# EAGLE schematic mainBoard_GTernal_1-1 v27 (EAGLE 9.7.0)

## Sheet 1 of 5
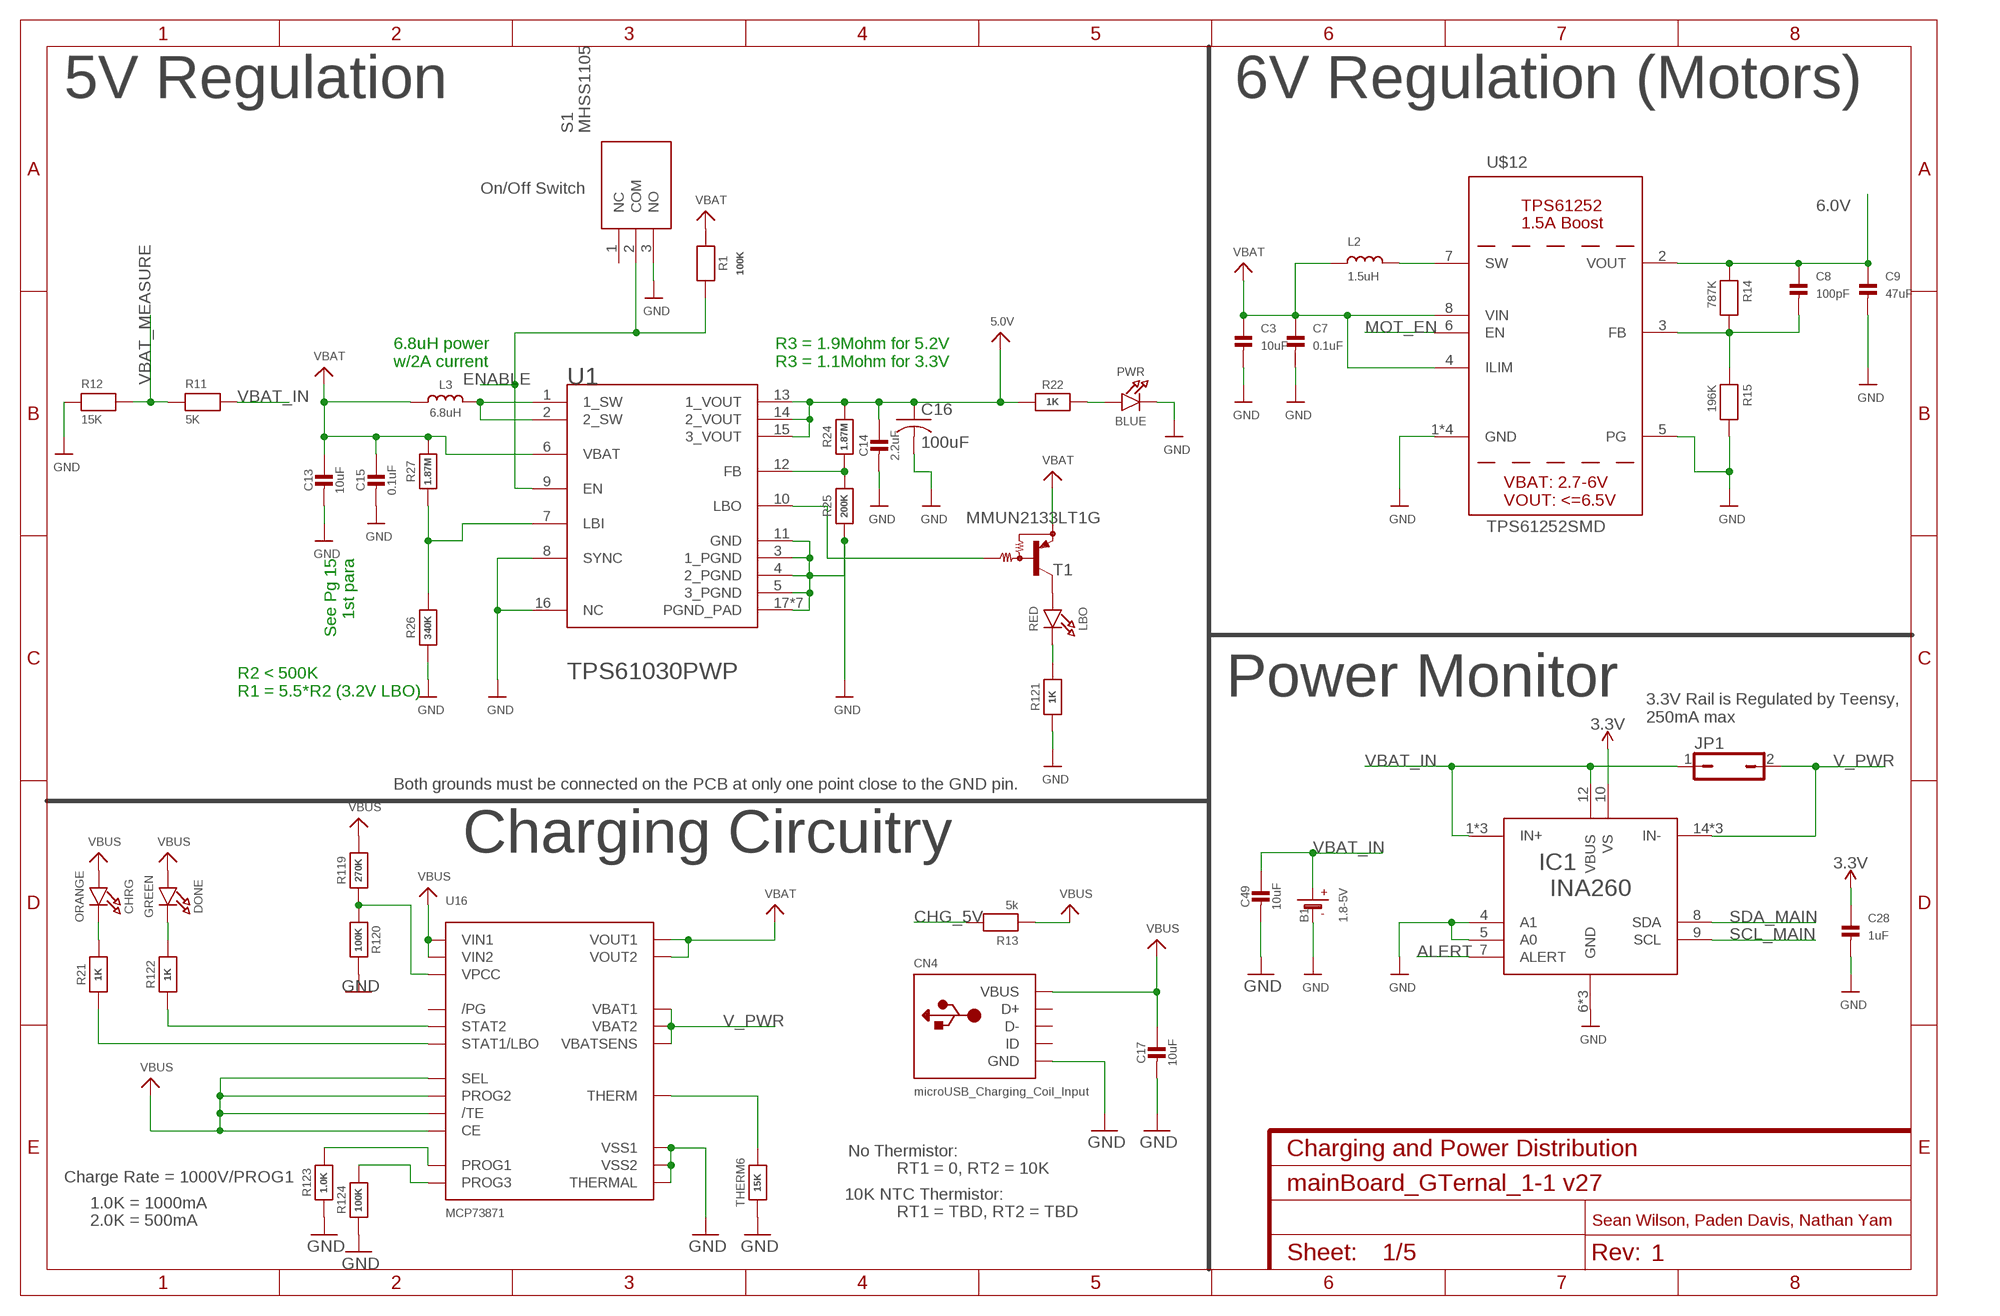
[diagram p0: schematic, sheet 1]
FRAME1 (FRAME-A4L): CNAME: Charging and Power Distribution; CREVISION: 1; DESIGNER: Sean Wilson, Paden Davis, Nathan Yam

### Parts
B1  1.8-5V  BATTERY  [JSTPH2]
C3  10uF  CAP_CERAMIC0603  [0603]
C7  0.1uF  CAP_CERAMIC0805  [0805]
C8  100pF  CAP_CERAMIC0603  [0603]
C9  47uF  CAP_CERAMIC1206  [1206]
C13  10uF  CAP_CERAMIC0805-NOOUTLINE  [0805-NO]
C14  2.2uF  CAP_CERAMIC0805-NOOUTLINE  [0805-NO]
C15  0.1uF  CAP_CERAMIC0805_10MGAP  [0805_10MGAP]
C16  100uF  C-USC1210  [C1210]
C17  10uF  CAP_CERAMIC0805-NOOUTLINE  [0805-NO]
C28  1uF  CAP_CERAMIC0603_NO  [0603-NO]
C49  10uF  CAP_CERAMIC0805-NOOUTLINE  [0805-NO]
CHRG  ORANGE  LED0805_NOOUTLINE  [CHIPLED_0805_NOOUTLINE]
CN4  microUSB_Charging_Coil_Input  USBMICRO_20329  [4UCONN_20329]
DONE  GREEN  LED0805_NOOUTLINE  [CHIPLED_0805_NOOUTLINE]
IC1  INA260  [TSSOP16]
JP1  JP1Q  [JP1]
L2  1.5uH  MURATA_DFE252012P-1R5M=P2  [MURATA_DFE252012P-1R5M=P2]
L3  6.8uH  INDUCTORTDK_VLC5045  [INDUCTOR_5X5MM_TDK_VLC5045]
LBO  RED  LED0805_NOOUTLINE  [CHIPLED_0805_NOOUTLINE]
PWR  BLUE  LED0805_NOOUTLINE  [CHIPLED_0805_NOOUTLINE]
R1  100K  RESISTOR0805_NOOUTLINE  [0805-NO]
R11  5K  RESISTOR0805  [0805]
R12  15K  RESISTOR0805  [0805]
R13  5k  RESISTOR0805  [0805]
R14  787K  RESISTOR0805  [0805]
R15  196K  RESISTOR0805  [0805]
R21  1K  RESISTOR0805_NOOUTLINE  [0805-NO]
R22  1K  RESISTOR0805_NOOUTLINE  [0805-NO]
R24  1.87M  RESISTOR0805_NOOUTLINE  [0805-NO]
R25  200K  RESISTOR0805_NOOUTLINE  [0805-NO]
R26  340K  RESISTOR_0805MP  [_0805MP]
R27  1.87M  RESISTOR_0805MP  [_0805MP]
R119  270K  RESISTOR0805_NOOUTLINE  [0805-NO]
R120  100K  RESISTOR0805_NOOUTLINE  [0805-NO]
R121  1K  RESISTOR0805_NOOUTLINE  [0805-NO]
R122  1K  RESISTOR0805_NOOUTLINE  [0805-NO]
R123  1.0K  RESISTOR0805_NOOUTLINE  [0805-NO]
R124  100K  RESISTOR0805_NOOUTLINE  [0805-NO]
S1  MHSS1105  [MHSS1105]
T1  MMUN2133LT1G  MUN2114T1-PNP_DRIVER-SC59-BEC  [SC59-BEC]
THERM6  15K  RESISTOR0805_NOOUTLINE  [0805-NO]
U1  TEXAS_INSTRUMENTS_TPS61030PWPTEXAS_INSTRUMENTS_TPS61030PWP_0_0  [TEXAS_INSTRUMENTS_TPS61030PWP_0]
U16  MCP73871  [QFN20_4MM]
U$12  TPS61252SMD  [TPS61252]

### Nets
3.3V: C28.1 IC1.10(VS) ; also sheet 2,4,5
5.0V: C14.1 C16.1 R22.1 R24.2 U1.13(1_VOUT) U1.14(2_VOUT) U1.15(3_VOUT) ; also sheet 2,3,5
6.0V: C8.1 C9.1 R14.1 U$12.2(VOUT) ; also sheet 3
ALERT: IC1.7(ALERT)
CHG_5V: R13.2 ; also sheet 2
ENABLE: R1.2 S1.2(COM) U1.9(EN)
GND: B1.1(-) C3.2 C7.2 C9.2 C13.2 C14.2 C15.2 C16.2 C17.2 C28.2 C49.2 CN4.BASE@1(GND) CN4.BASE@2(GND) CN4.GND CN4.SPRT@1(GND) CN4.SPRT@2(GND) CN4.SPRT@3(GND) CN4.SPRT@4(GND) IC1.4(A1) IC1.5(A0) IC1.6(GND) IC1.11(GND) IC1.13(GND) PWR.C R12.1 R15.2 R25.1 R26.1 R120.2 R121.1 R123.1 R124.1 S1.3(NO) THERM6.1 U1.3(1_PGND) U1.4(2_PGND) U1.5(3_PGND) U1.8(SYNC) U1.11(GND) U1.16(NC) U1.17(PGND_PAD) U1.PAD_1(PGND_PAD) U1.PAD_2(PGND_PAD) U1.PAD_3(PGND_PAD) U1.PAD_4(PGND_PAD) U1.PAD_5(PGND_PAD) U1.PAD_6(PGND_PAD) U16.P$10(VSS1) U16.P$11(VSS2) U16.P$21(THERMAL) U$12.1(GND) U$12.5(PG) U$12.P$2_GND(GND) U$12.P$3_GND(GND) U$12.THERMAL_GND(GND) ; also sheet 2,3,4,5
MOT_EN: U$12.6(EN) ; also sheet 2
N$1: R24.1 R25.2 U1.12(FB)
N$2: LBO.A T1.C
N$6: T1.B U1.10(LBO)
N$8: CHRG.C R21.2
N$11: L2.P$2 U$12.7(SW)
N$12: C8.2 R14.2 R15.1 U$12.3(FB)
N$13: L3.P$2 U1.1(1_SW) U1.2(2_SW)
N$14: R26.2 R27.1 U1.7(LBI)
N$19: PWR.A R22.2
N$100: R119.1 R120.1 U16.P$2(VPCC)
N$101: R122.1 U16.P$7(STAT2)
N$102: R21.1 U16.P$8(STAT1/LBO)
N$103: R123.2 U16.P$13(PROG1)
N$104: THERM6.2 U16.P$5(THERM)
N$105: DONE.C R122.2
N$106: LBO.C R121.2
N$107: R124.2 U16.P$12(PROG3)
SCL_MAIN: IC1.9(SCL) ; also sheet 2,4,5
SDA_MAIN: IC1.8(SDA) ; also sheet 2,4,5
V_PWR: IC1.14(IN-) IC1.15(IN-) IC1.16(IN-) JP1.2 U16.P$14(VBAT1) U16.P$15(VBAT2) U16.P$16(VBATSENS)
VBAT: C3.1 C7.1 C13.1 C15.1 L2.P$1 L3.P$1 R1.1 R27.2 T1.E U1.6(VBAT) U16.P$1(VOUT1) U16.P$20(VOUT2) U$12.4(ILIM) U$12.8(VIN) ; also sheet 2
VBAT_IN: B1.2(+) C49.1 IC1.1(IN+) IC1.2(IN+) IC1.3(IN+) IC1.12(VBUS) JP1.1 R11.2
VBAT_MEASURE: R11.1 R12.2 ; also sheet 2
VBUS: C17.1 CHRG.A CN4.VBUS DONE.A R13.1 R119.2 U16.P$3(SEL) U16.P$4(PROG2) U16.P$9(/TE) U16.P$17(CE) U16.P$18(VIN1) U16.P$19(VIN2)
Unconnected: CN4.D+ CN4.D- CN4.ID S1.1(NC) U16.P$6(/PG)

### Notes on the sheet
- 5V Regulation | 6V Regulation (Motors)
- On/Off Switch
- 6.8uH power
  w/2A current
- R3 = 1.9Mohm for 5.2V
  R3 = 1.1Mohm for 3.3V
- See Pg 15
  1st para
- R2 < 500K
  R1 = 5.5*R2 (3.2V LBO)
- Power Monitor
- 3.3V Rail is Regulated by Teensy,
  250mA max
- Both grounds must be connected on the PCB at only one point close to the GND pin.
- Charging Circuitry
- No Thermistor:
- RT1 = 0, RT2 = 10K
- Charge Rate = 1000V/PROG1
- 10K NTC Thermistor:
- 1.0K = 1000mA
- RT1 = TBD, RT2 = TBD
- 2.0K = 500mA

## Sheet 2 of 5
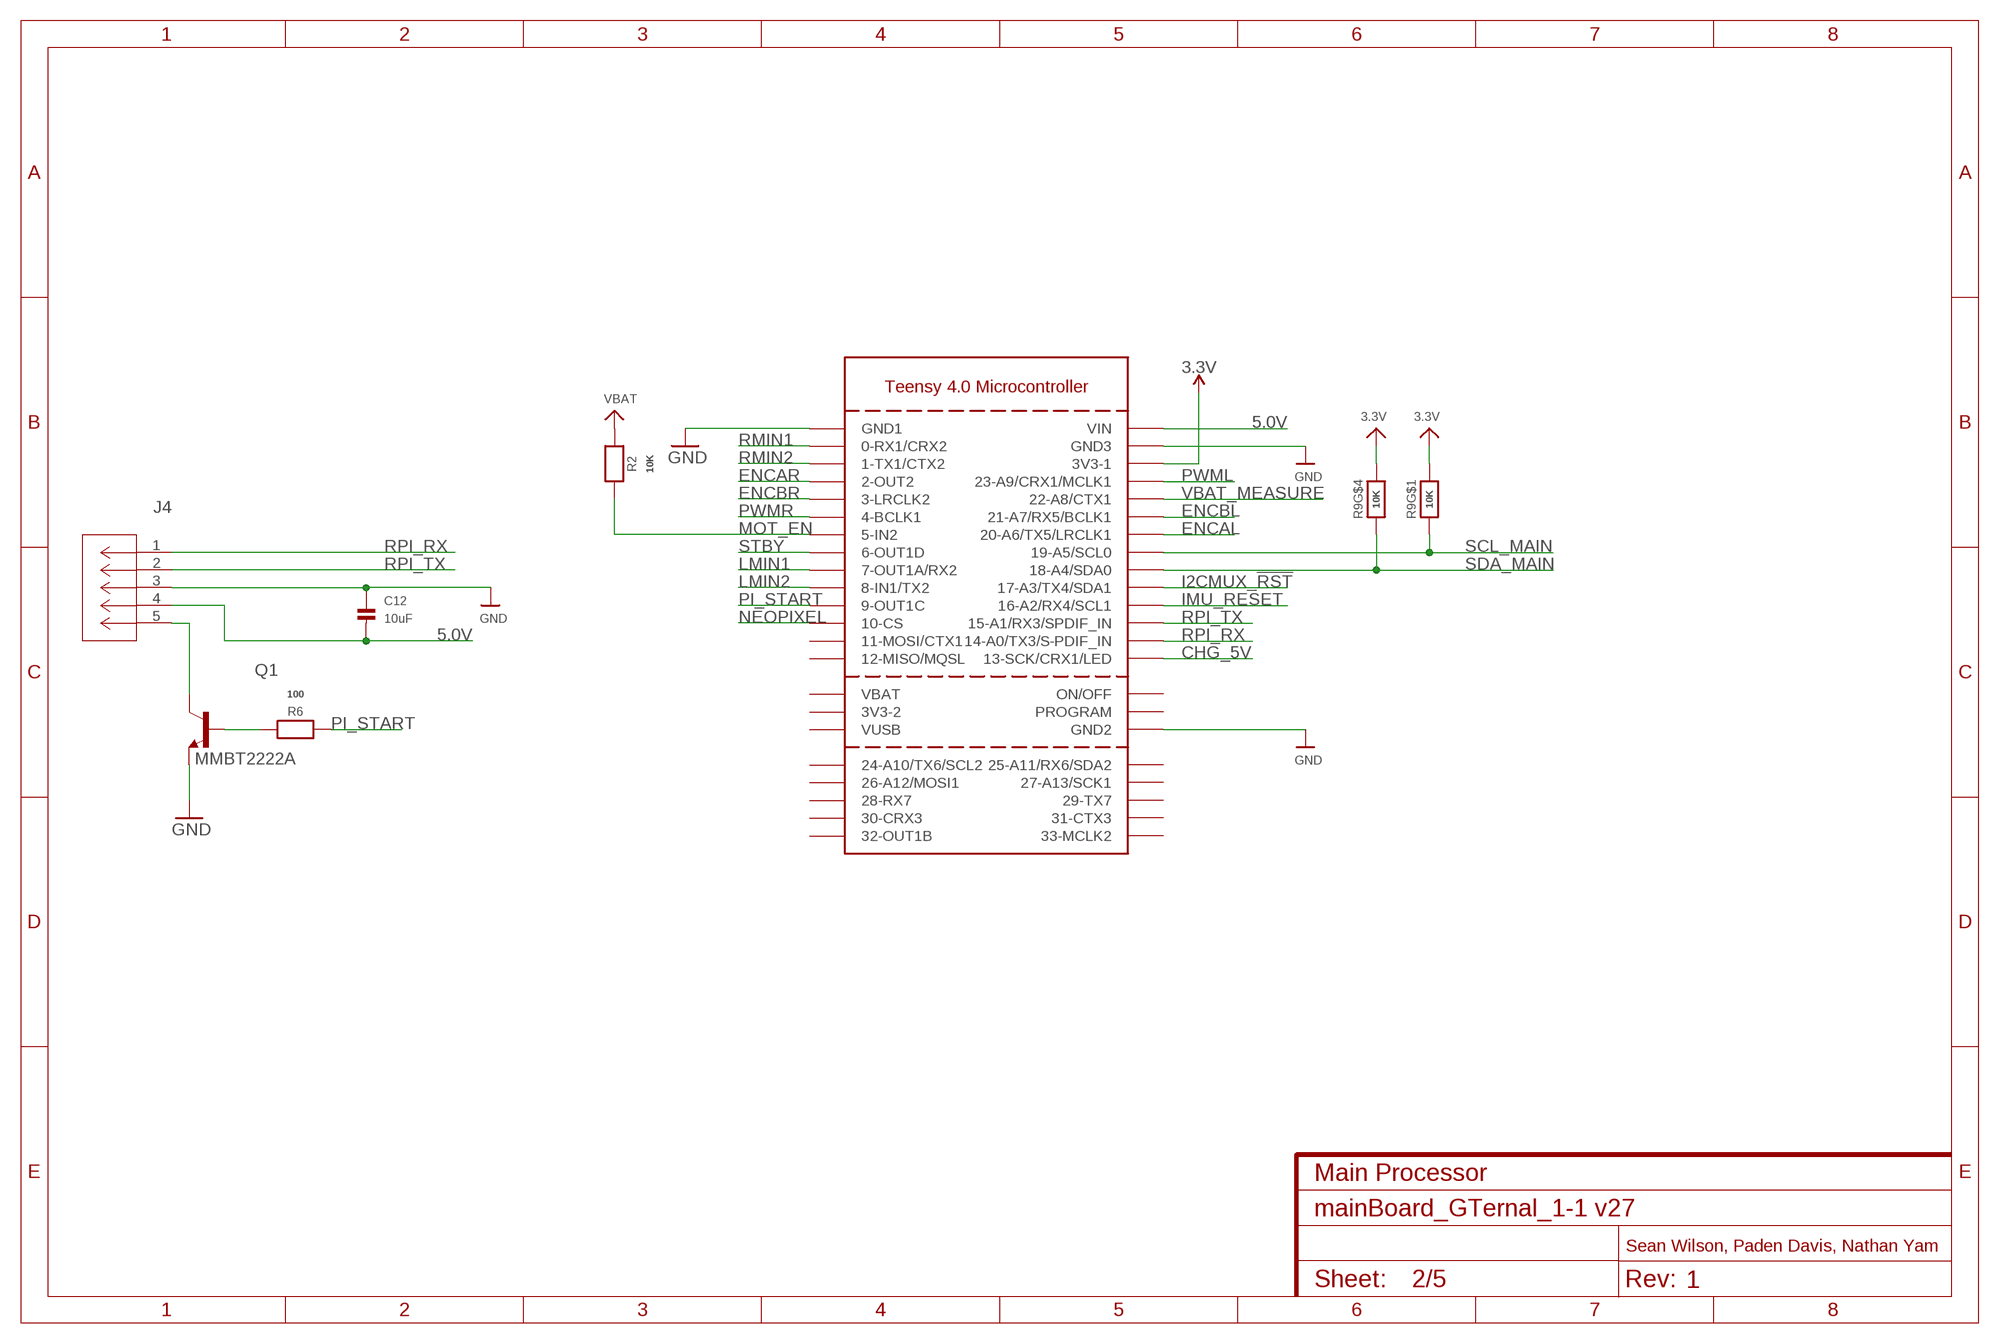
[diagram p1: schematic, sheet 2]
FRAME2 (FRAME-A4L): CNAME: Main Processor; CREVISION: 1; DESIGNER: Sean Wilson, Paden Davis, Nathan Yam

### Parts
C12  10uF  CAP_CERAMIC0603  [0603]
J4  3A/250V  B5B-XH-ACONN_B5B-XH-A_JST  [CONN_B5B-XH-A_JST]
Q1  MMBT2222A  [SOT23]
R2  10K  RESISTOR0805_NOOUTLINE  [0805-NO]
R6  100  RESISTOR0805_NOOUTLINE  [0805-NO]
R9  10K  RESISTOR_4PACK  [RESPACK_4X0603]
U$57  TEENSY40  [TEENSY40]

### Nets
3.3V: R9.1 R9.4 U$57.3V3-1 ; also sheet 1,4,5
5.0V: C12.2 J4.4 U$57.VIN ; also sheet 1,3,5
CHG_5V: U$57.13-SCK/CRX1/LED ; also sheet 1
ENCAL: U$57.20-A6/TX5/LRCLK1 ; also sheet 3
ENCAR: U$57.2-OUT2 ; also sheet 3
ENCBL: U$57.21-A7/RX5/BCLK1 ; also sheet 3
ENCBR: U$57.3-LRCLK2 ; also sheet 3
GND: C12.1 J4.3 Q1.2(E) U$57.GND1 U$57.GND2 U$57.GND3 ; also sheet 1,3,4,5
I2CMUX_!RST: U$57.17-A3/TX4/SDA1 ; also sheet 4
IMU_RESET: U$57.16-A2/RX4/SCL1 ; also sheet 5
LMIN1: U$57.7-RX2/OUT1A(7-OUT1A/RX2) ; also sheet 3
LMIN2: U$57.8-TX2/IN1(8-IN1/TX2) ; also sheet 3
MOT_EN: R2.2 U$57.5-IN2 ; also sheet 1
N$7: Q1.1(B) R6.1
N$10: J4.5 Q1.3(C)
NEOPIXEL: U$57.10-CS/MQSR(10-CS) ; also sheet 5
PI_START: R6.2 U$57.9-OUT1C
PWML: U$57.23-A9/CRX1/CCLK1(23-A9/CRX1/MCLK1) ; also sheet 3
PWMR: U$57.4-BCLK2(4-BCLK1) ; also sheet 3
RMIN1: U$57.0-RX1(0-RX1/CRX2) ; also sheet 3
RMIN2: U$57.1-TX1(1-TX1/CTX2) ; also sheet 3
RPI_RX: J4.1 U$57.14-A0/TX3/S-PFI_OUT(14-A0/TX3/S-PDIF_IN)
RPI_TX: J4.2 U$57.15-A1/RX3/S-PDIF_IN(15-A1/RX3/SPDIF_IN)
SCL_MAIN: R9.8 U$57.19-A5/SCL0 ; also sheet 1,4,5
SDA_MAIN: R9.5 U$57.18-A4/SDA0 ; also sheet 1,4,5
STBY: U$57.6-OUT1D ; also sheet 3
VBAT: R2.1 ; also sheet 1
VBAT_MEASURE: U$57.22-A8/CTX1 ; also sheet 1
Unconnected: R9.2 R9.3 R9.6 R9.7 U$57.3V3-2 U$57.11-MOSI/CTX1 U$57.12-MIO/MQSL(12-MISO/MQSL) U$57.24-A10/TX6/SCL2 U$57.25-A11/SDA2(25-A11/RX6/SDA2) U$57.26-A12/MOSI1 U$57.27-A13/SCK1 U$57.28-RX7 U$57.29-TX7 U$57.30-CRX3 U$57.31-CTX3 U$57.32-OUTB1(32-OUT1B) U$57.33-MCLK2 U$57.ON/OFF U$57.PROGRAM U$57.VBAT U$57.VUSB

## Sheet 3 of 5
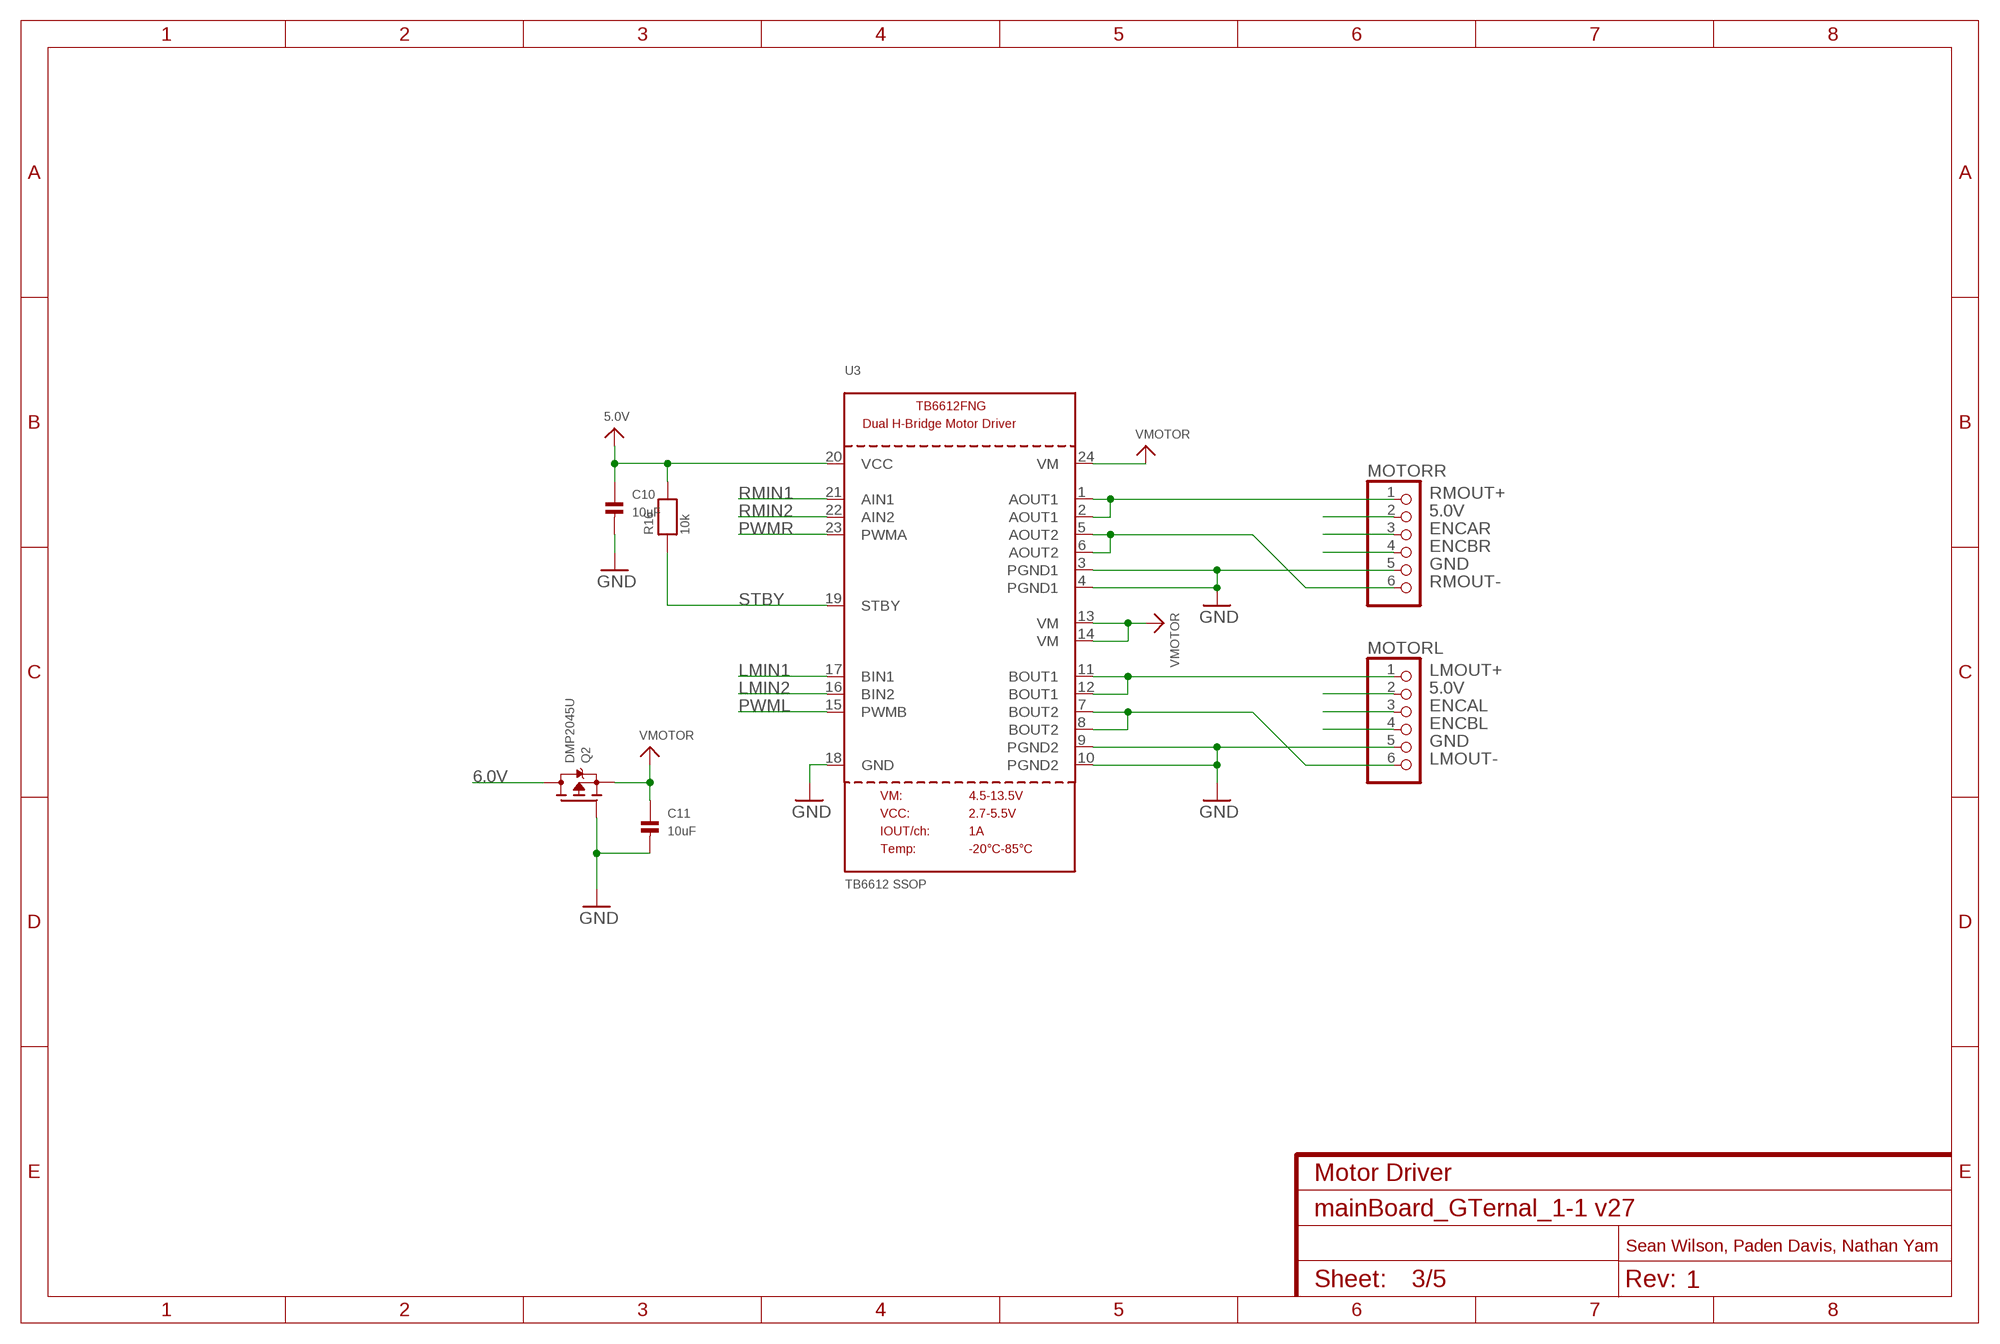
[diagram p2: schematic, sheet 3]
FRAME3 (FRAME-A4L): CNAME: Motor Driver; CREVISION: 1; DESIGNER: Sean Wilson, Paden Davis, Nathan Yam

### Parts
C10  10uF  CAP_CERAMIC0603  [0603]
C11  10uF  CAP_CERAMIC0603  [0603]
MOTORL  PINHD-1X6CB  [1X06-CLEANBIG]
MOTORR  PINHD-1X6CB  [1X06-CLEANBIG]
Q2  DMP2045U  MOSFET-PWIDE  [SOT23-WIDE]
R16  10k  RESISTOR0805  [0805]
U3  TB6612 SSOP  TB6612FNGSSOP  [SSOP24]

### Nets
5.0V: C10.1 MOTORL.2 MOTORR.2 R16.2 U3.20(VCC) ; also sheet 1,2,5
6.0V: Q2.3(D) ; also sheet 1
ENCAL: MOTORL.3 ; also sheet 2
ENCAR: MOTORR.3 ; also sheet 2
ENCBL: MOTORL.4 ; also sheet 2
ENCBR: MOTORR.4 ; also sheet 2
GND: C10.2 C11.2 MOTORL.5 MOTORR.5 Q2.1(G) U3.3(PGND1) U3.4(PGND1) U3.9(PGND2) U3.10(PGND2) U3.18(GND) ; also sheet 1,2,4,5
LMIN1: U3.17(BIN1) ; also sheet 2
LMIN2: U3.16(BIN2) ; also sheet 2
LMOUT+: MOTORL.1 U3.11(BOUT1) U3.12(BOUT1)
LMOUT-: MOTORL.6 U3.7(BOUT2) U3.8(BOUT2)
PWML: U3.15(PWMB) ; also sheet 2
PWMR: U3.23(PWMA) ; also sheet 2
RMIN1: U3.21(AIN1) ; also sheet 2
RMIN2: U3.22(AIN2) ; also sheet 2
RMOUT+: MOTORR.1 U3.1(AOUT1) U3.2(AOUT1)
RMOUT-: MOTORR.6 U3.5(AOUT2) U3.6(AOUT2)
STBY: R16.1 U3.19(STBY) ; also sheet 2
VMOTOR: C11.1 Q2.2(S) U3.13(VM) U3.14(VM) U3.24(VM)

## Sheet 4 of 5
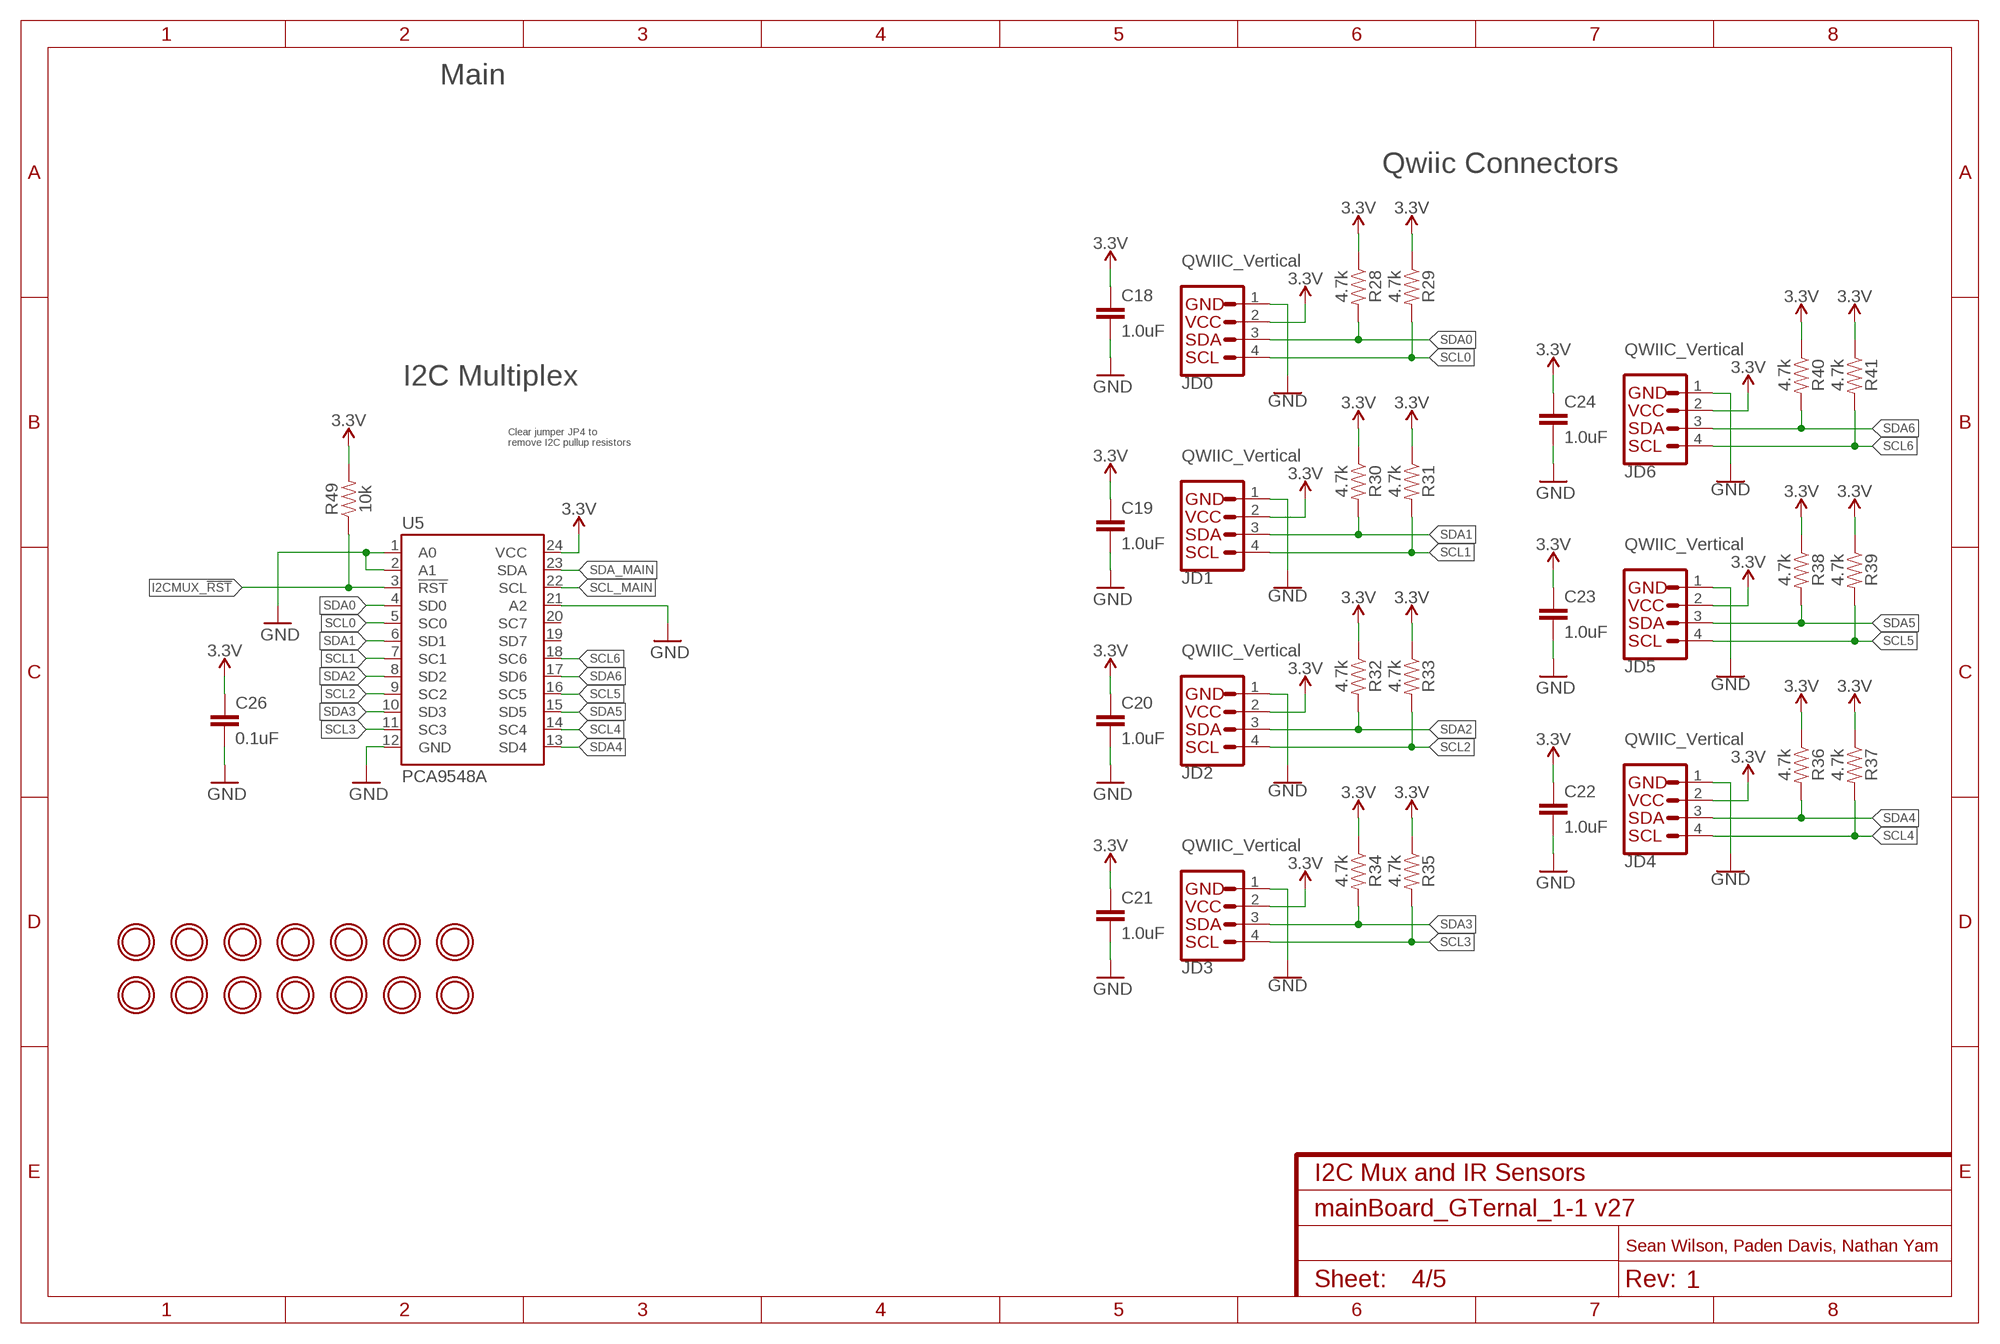
[diagram p3: schematic, sheet 4]
FRAME4 (FRAME-A4L): CNAME: I2C Mux and IR Sensors; CREVISION: 1; DESIGNER: Sean Wilson, Paden Davis, Nathan Yam

### Parts
C18  1.0uF  1.0UF-0603-16V-10%  [0603]
C19  1.0uF  1.0UF-0603-16V-10%  [0603]
C20  1.0uF  1.0UF-0603-16V-10%  [0603]
C21  1.0uF  1.0UF-0603-16V-10%  [0603]
C22  1.0uF  1.0UF-0603-16V-10%  [0603]
C23  1.0uF  1.0UF-0603-16V-10%  [0603]
C24  1.0uF  1.0UF-0603-16V-10%  [0603]
C26  0.1uF  0.1UF-0603-25V-(+80/-20%)  [0603]
JD0  QWIIC_Vertical  QWIIC_CONNECTOR  [JST04_1MM_VERT]
JD1  QWIIC_Vertical  QWIIC_CONNECTOR  [JST04_1MM_VERT]
JD2  QWIIC_Vertical  QWIIC_CONNECTOR  [JST04_1MM_VERT]
JD3  QWIIC_Vertical  QWIIC_CONNECTOR  [JST04_1MM_VERT]
JD4  QWIIC_Vertical  QWIIC_CONNECTOR  [JST04_1MM_VERT]
JD5  QWIIC_Vertical  QWIIC_CONNECTOR  [JST04_1MM_VERT]
JD6  QWIIC_Vertical  QWIIC_CONNECTOR  [JST04_1MM_VERT]
R28  4.7k  4.7KOHM-0603-1/10W-1%  [0603]
R29  4.7k  4.7KOHM-0603-1/10W-1%  [0603]
R30  4.7k  4.7KOHM-0603-1/10W-1%  [0603]
R31  4.7k  4.7KOHM-0603-1/10W-1%  [0603]
R32  4.7k  4.7KOHM-0603-1/10W-1%  [0603]
R33  4.7k  4.7KOHM-0603-1/10W-1%  [0603]
R34  4.7k  4.7KOHM-0603-1/10W-1%  [0603]
R35  4.7k  4.7KOHM-0603-1/10W-1%  [0603]
R36  4.7k  4.7KOHM-0603-1/10W-1%  [0603]
R37  4.7k  4.7KOHM-0603-1/10W-1%  [0603]
R38  4.7k  4.7KOHM-0603-1/10W-1%  [0603]
R39  4.7k  4.7KOHM-0603-1/10W-1%  [0603]
R40  4.7k  4.7KOHM-0603-1/10W-1%  [0603]
R41  4.7k  4.7KOHM-0603-1/10W-1%  [0603]
R49  10k  10KOHM-0603-1/10W-1%  [0603]
U5  PCA9548A  [TSSOP28]
U$8  MOUNTINGHOLE2.5  [MOUNTINGHOLE_2.5_PLATED]
U$30  MOUNTINGHOLE2.5  [MOUNTINGHOLE_2.5_PLATED]
U$31  MOUNTINGHOLE2.5  [MOUNTINGHOLE_2.5_PLATED]
U$32  MOUNTINGHOLE2.5  [MOUNTINGHOLE_2.5_PLATED]
U$33  MOUNTINGHOLE2.5  [MOUNTINGHOLE_2.5_PLATED]
U$34  MOUNTINGHOLE2.5  [MOUNTINGHOLE_2.5_PLATED]
U$35  MOUNTINGHOLE2.5  [MOUNTINGHOLE_2.5_PLATED]
U$36  MOUNTINGHOLE2.5  [MOUNTINGHOLE_2.5_PLATED]
U$37  MOUNTINGHOLE2.5  [MOUNTINGHOLE_2.5_PLATED]
U$43  MOUNTINGHOLE2.5  [MOUNTINGHOLE_2.5_PLATED]
U$45  MOUNTINGHOLE2.5  [MOUNTINGHOLE_2.5_PLATED]
U$46  MOUNTINGHOLE2.5  [MOUNTINGHOLE_2.5_PLATED]
U$47  MOUNTINGHOLE2.5  [MOUNTINGHOLE_2.5_PLATED]
U$48  MOUNTINGHOLE2.5  [MOUNTINGHOLE_2.5_PLATED]

### Nets
3.3V: C18.1 C19.1 C20.1 C21.1 C22.1 C23.1 C24.1 C26.1 JD0.2 JD1.2 JD2.2 JD3.2 JD4.2 JD5.2 JD6.2 R28.1 R29.1 R30.1 R31.1 R32.1 R33.1 R34.1 R35.1 R36.1 R37.1 R38.1 R39.1 R40.1 R41.1 R49.2 U5.24(VCC) ; also sheet 1,2,5
GND: C18.2 C19.2 C20.2 C21.2 C22.2 C23.2 C24.2 C26.2 JD0.1 JD1.1 JD2.1 JD3.1 JD4.1 JD5.1 JD6.1 U5.1(A0) U5.2(A1) U5.12(GND) U5.21(A2) ; also sheet 1,2,3,5
I2CMUX_!RST: R49.1 U5.3(!RST) ; also sheet 2
SCL0: JD0.4 R29.2 U5.5(SC0)
SCL1: JD1.4 R31.2 U5.7(SC1)
SCL2: JD2.4 R33.2 U5.9(SC2)
SCL3: JD3.4 R35.2 U5.11(SC3)
SCL4: JD4.4 R37.2 U5.14(SC4)
SCL5: JD5.4 R39.2 U5.16(SC5)
SCL6: JD6.4 R41.2 U5.18(SC6)
SCL_MAIN: U5.22(SCL) ; also sheet 1,2,5
SDA0: JD0.3 R28.2 U5.4(SD0)
SDA1: JD1.3 R30.2 U5.6(SD1)
SDA2: JD2.3 R32.2 U5.8(SD2)
SDA3: JD3.3 R34.2 U5.10(SD3)
SDA4: JD4.3 R36.2 U5.13(SD4)
SDA5: JD5.3 R38.2 U5.15(SD5)
SDA6: JD6.3 R40.2 U5.17(SD6)
SDA_MAIN: U5.23(SDA) ; also sheet 1,2,5
Unconnected: U5.19(SD7) U5.20(SC7)

### Notes on the sheet
- Main
- Qwiic Connectors
- I2C Multiplex
- Clear jumper JP4 to 
  remove I2C pullup resistors

## Sheet 5 of 5
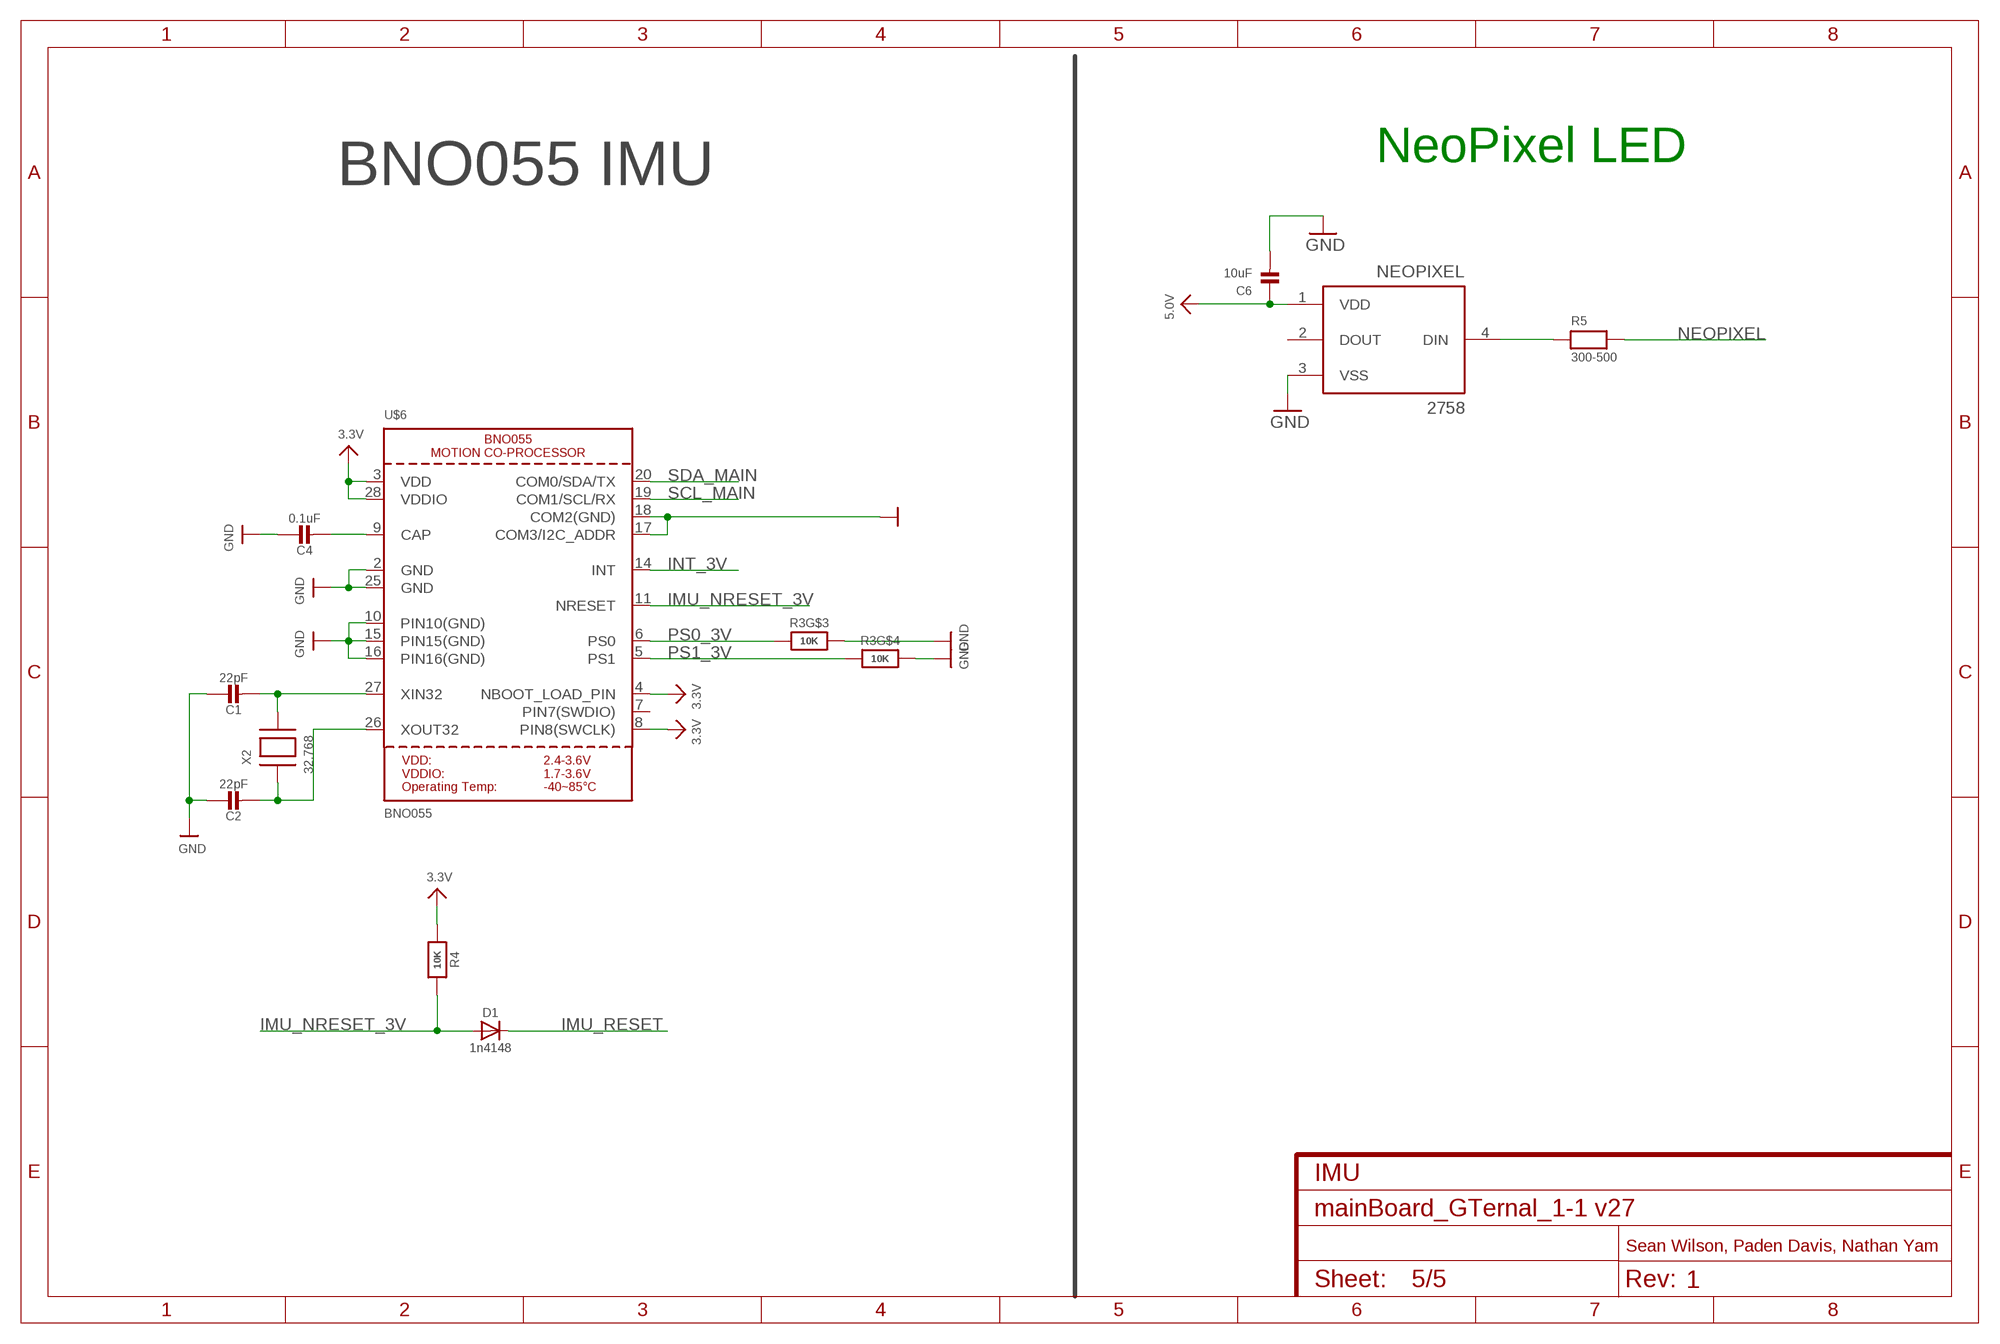
[diagram p4: schematic, sheet 5]
FRAME5 (FRAME-A4L): CNAME: IMU; CREVISION: 1; DESIGNER: Sean Wilson, Paden Davis, Nathan Yam

### Parts
C1  22pF  CAP_CERAMIC0603_NO  [0603-NO]
C2  22pF  CAP_CERAMIC0603_NO  [0603-NO]
C4  0.1uF  CAP_CERAMIC0603_NO  [0603-NO]
C6  10uF  CAP_CERAMIC0603  [0603]
D1  1n4148  DIODESOD-323  [SOD-323]
NEOPIXEL  2758  [SOL320P540X170-4N]
R3  10K  RESISTOR_4PACK  [RESPACK_4X0603]
R4  10K  RESISTOR_0603_NOOUT  [0603-NO]
R5  300-500  RESISTOR0805  [0805]
U$6  BNO055  [BNO055]
X2  32.768  XTAL-3.2X1.5  [XTAL3215]

### Nets
3.3V: R4.1 U$6.3(VDD) U$6.4(NBOOT_LOAD_PIN) U$6.8(PIN8(SWCLK)) U$6.28(VDDIO) ; also sheet 1,2,4
5.0V: C6.1 NEOPIXEL.1(VDD) ; also sheet 1,2,3
GND: C1.1 C2.1 C4.1 C6.2 NEOPIXEL.3(VSS) R3.5 R3.6 U$6.2(GND) U$6.10(PIN10(GND)) U$6.15(PIN15(GND)) U$6.16(PIN16(GND)) U$6.17(COM3/I2C_ADDR) U$6.18(COM2(GND)) U$6.25(GND) ; also sheet 1,2,3,4
IMU_NRESET_3V: D1.A R4.2 U$6.11(NRESET)
IMU_RESET: D1.C ; also sheet 2
INT_3V: U$6.14(INT)
N$3: C1.2 U$6.27(XIN32) X2.P$2
N$4: C2.2 U$6.26(XOUT32) X2.P$1
N$5: C4.2 U$6.9(CAP)
N$18: NEOPIXEL.4(DIN) R5.1
NEOPIXEL: R5.2 ; also sheet 2
PS0_3V: R3.3 U$6.6(PS0)
PS1_3V: R3.4 U$6.5(PS1)
SCL_MAIN: U$6.19(COM1/SCL/RX) ; also sheet 1,2,4
SDA_MAIN: U$6.20(COM0/SDA/TX) ; also sheet 1,2,4
Unconnected: NEOPIXEL.2(DOUT) R3.1 R3.2 R3.7 R3.8 U$6.7(PIN7(SWDIO))

### Notes on the sheet
- BNO055 IMU | NeoPixel LED

## Library data of the parts
B1 = microbuilder:BATTERY: CR1220 SMT - Digikey: 3001K-ND CD2032 BAT-HLD-001 - Digikey: BAT-HLD-001-ND
C1-C4 C6-C15 C17 C28 C49 = microbuilder:CAP_CERAMIC: Ceramic Capacitors
C16 = rcl:C-US: CAPACITOR, American symbol
C18-C24 = SparkFun-Capacitors:1.0UF: 1µF ceramic capacitors A capacitor is a passive two-terminal electrical component used to store electrical energy temporarily in an electric field.; PROD_ID: CAP-00868
C26 = SparkFun-Capacitors:0.1UF: 0.1µF ceramic capacitors A capacitor is a passive two-terminal electrical component used to store electrical energy temporarily in an electric field.; PROD_ID: CAP-00810
CHRG DONE LBO PWR = microbuilder:LED: LED 0603 - 0603 Surface Mount Package 2mA: Green LED - Low Power (3.9mcd, 2ma, 1.7Vf) - Digikey: 475-2709-2-ND Orange LED - Low Power (9.8mcd, 2ma, 1.8Vf) - Digikey: 475-1194-2-ND Red LED - Low Power (5mcd, 2ma, 1.8Vf) - Digikey: 475-1195-2-ND Yellow LED - Low Power (7mcd, 2ma, 1.8Vf) - Digikey: 475-1196-2-ND 5mA: Blue LED - Low Power (17mcd, 5ma, 2.9Vf) - Digikey: LNJ937W8CRACT-ND 0805 - 0805 Surface Mount Package 2mA: Red LED (8.8mcd, 2mA, 1.8Vf, Clear) - Low Power [Digikey: 475-2510-1-ND] Green LED (5mcd, 2mA, 1.8Vf, Clear) - Low Power [Digikey: 475-2730-1-ND] Yellow LED (11.3mcd, 2mA, 1.8Vf, Clear) - Low Power [Digikey: 475-2555-1-ND] 20mA: Red LED (104mcd, 20mA, Diffused) - LS R976 [Digikey: 475-1278-6-ND] Red LED (12mcd, 20mA, 2.0Vf, Clear) - APT2012EC [Digikey: 754-1128-1-ND] Green LED (15mcd, 20mA, 2.2Vf, Clear) - APT2012GC [Digikey: 754-1131-1-ND] Orange LED (160mcd, 20mA, 2.1Vf, Clear) - APT2012SECK [Digikey: 754-1130-1-ND] 1206 - 1206 Surface Mount Package Green LED (26mcd, 20mA, Diffused) - LG N971 [Digikey: 475-1407-6-ND] Red LED (15mcd, 20mA, Diffused) - LH N974 [Digikey: 475-1416-6-ND] Cree - Cree High-Power Surface Mount LEDs XPEBWT-L1-0000-00D50 - White 111lm 350mA 2.9Vf 6200K 110° XTEAWT-00-0000-00000LEE3 - White 114lm 350mA 2.85Vf 5000K 115° Everlight - Everlight 45-21 Series Surface Mount LEDs 45-21/QK2C-B2832AC2CB2/2T - Warm White 2000mcd 20mA 3.25Vf 3050K 120° 45-21/LK2C-B38452C4CB2/2T - Nuetral White 2000mcd 20mA 3.25Vf 4150K 120° 45-21/LK2C-B50634C6CB2/2T - Cold White 2200mcd 20mA 3.25Vf 5650K 120° PLCC2 Reverse Mount LS T77K-J1L2-1-0-2-R18-Z - Red 11.25mcd 2mA 1.8Vf 630nm 120° LO T77K-L1M2-24-Z - Orange 19.6mcd 2mA 1.8Vf 606nm 120° LY T77K-K2M1-26-Z - Yellow 15.7mcd 2mA 1.8Vf 587nm 120°
CN4 = microbuilder:USB: USB Connectors USBMINIB - Surface Mount Female Mini-B USB Connector 4UConnector: 06564
D1 = microbuilder:DIODE: Diode SMA Model Volts Amps Type Vf Ir Digikey # Notes SSA34-E3 40V 3A Schottky 480mV @ 3A 200uA @ 40V SSA34-E3/61TGITR-ND CDBA120-G 20V 1A Schottky 500mV @ 1A 500uA @ 20V 641-1014-6-ND REEL MBRA210 10V 2A Schottky 350mV @ 2A 700uA @ 10V MBRA210LT3 SOD-123 Model Volts Amps Type Vf Ir Order # Notes BAT54T1G 30V 200mA Schottky 800mV @ 200mA 2uA @ 25V BAT54T1GOSTR-ND B0530W 30V 500mA Schottky 430mV @ 500mA 130uA @ 30V B0530W-FDICT-ND REEL MBR120 20V 1A Schottky 340mV @ 1A MBR120VLSFT1GOSCT-ND SOD-323 Model Volts Amps Type Vf Ir Order # Notes PMEG2005EJ 20V 500mA Schottky 355mV @ 500mA 568-4110-1-ND ZLLS410 10V 570mA Schottky 380mV @ 570mA ZLLS410CT-ND 1N4148WS 75V 150mA Silicon/Simple 1V 1N4148WSFSCT-ND REEL SOD-523 Model Volts Amps Type Vf Ir Order # Notes BAT54XV2 30V 200mA Schottky 0.8V @ 100mA BAT54XV2CT-ND TB751S 30V 30mA Schottky RB751S-40TE61CT-ND SOT23-R/W (R = Solder Paste/Reflow Ovens, W = Hand-Soldering) Model Volts Amps Type Vf Ir Order # Notes BAT54FILM 40V 300mA Schottky 497-7162-1-ND POWERDI-5 Model Volts Amps Type Vf Ir Order # Notes PDS560 60V 5A Schottky 670mV @ 5A 150uA @ 60V PDS560DICT-ND
IC1 = microbuilder:INA260
J4 = 2023-10-05_21-35-32_Library:B5B-XH-A; COPYRIGHT: Copyright (C) 2023 Ultra Librarian. All rights reserved.; MANUFACTURER_PART_NUMBER: B5B-XH-A; MFR_NAME: JST
JD0 JD1-JD6 = SparkFun-Connectors:QWIIC_CONNECTOR: SparkFun I2C Standard Qwiic Connector An SMD 1mm pitch JST connector makes it easy and quick (get it? Qwiic?) to connect I2C devices to each other. The Qwiic system <http://www.sparkfun.com/qwiic> enables fast and solderless connection between popular platforms and various sensors and actuators. We carry 200mm <https://www.sparkfun.com/products/14204>, 100mm <https://www.sparkfun.com/products/14205>, 50mm <https://www.sparkfun.com/products/14206>, and breadboard friendly <https://www.sparkfun.com/products/14207> Qwiic cables. We also offer 10 pcs strips <https://www.sparkfun.com/products/14323> the SMD connectors.; PROD_ID: CONN-14483; VALUE: Vertical Qwiic Connector
JP1 = jumper:JP1Q: JUMPER
L2 = gritsbotx_electronics:MURATA_DFE252012P-1R5M=P2
L3 = microbuilder:INDUCTOR: Inductors 0603: 10nH Ceramic Inductor - microwire antenna/RF (Digikey: 712-1434-2-ND) 0805: 560nH Ceramic Inductor - RF (Digikey: 553-1047-1-ND) 270nH Ceramic Inductor - Q = 40@250MHz, +-5%, 1 Ohm DC Resistance (Digikey: 535-10506-2-ND) 1007 (2518 Metric) SMT: 10µH 10% 250mOhm 820mA 1007 Inductor (Digikey: 587-2189-1-ND) 22µH 10% 500mOhm 580mA 1007 Inductor (Digikey: 587-2190-1-ND) 47µH 10% 950mOhm 420mA 1007 Inductor (Digikey: 587-2191-1-ND) 47µH 5% 100mOhm 1A 1008 Inductor (Digikey: 732-1816-1-ND) 5.0x5.0mm (Taiyo Yuden NR5040 Series) 6.8µH 20% 2.3A 64mOhm Inductor (Digikey: 587-2374-2-ND) 5.0x5.0mm (TDK VLC5045 Series) 4.7µH 20% 3.3A 34mOhm Inductor (Digikey: 445-6526-1-ND) 6.8µH 20% 2.7A 46mOhm Inductor (Digikey: 445-6527-1-ND) 6.0x6.0mm (TDK VLC6045 Series) 4.7µH 20% 3.8A 27mOhm Inductor (Digikey: 445-6538-2-ND) 6.8µH 20% 3A 41mOhm Inductor (Digikey: 445-6540-1-ND) 6.2µH 30% 2.2A 45mOhm Inductor (Digikey: SRR5028-6R2YCT-ND) - Not TDK VLC6045 but footprint should match 6.0x6.0mm (TDK SLF6045 Series) 6.8uH 30% 2A 33mOhm Inductor (Digikey: 445-4572-1-ND, Mouser: 810-SLF645T6R8N2R0PF) 6.0x6.0mm (Sumida CDRH5D28 Series) 6.2uH 30% 1.8A 45mOhm Inductor (Digikey: 308-1542-1-ND) Taiyo Yuden NR3015T2R2M - 2.2uH 20% 1.5A (Digikey: 587-1648-2-ND, Mouser: 963-NR3015T2R2M) - Used with TI TPS62172 CoilCraft RFID Transponder Coil - MA5532-AE (For use with AS3935 Lightning Sensor) Vishay IHLP 1.0uH Molded Inductor - 24mOhm DCR, 5A, +/-20%, -55°C-125°C (Digikey: 541-1319-1-ND)
MOTORL MOTORR = adafruit:PINHD-1X6: PIN HEADER
NEOPIXEL = 2758:2758: NeoPixel RGBW LEDs w/ Integrated DriverChip - Natural White - 4500K - White Ca Check availability <https://pricing.snapeda.com/parts/2758/Adafruit%20Industries/view-part?ref=eda>; AVAILABILITY: In Stock; CHECK_PRICES: https://www.snapeda.com/parts/2758/Adafruit+Industries+LLC/view-part/?ref=eda; DESCRIPTION: Addressable Lighting Neopixel 10 LED Discrete Serial (Shift Register) Red, Green, Blue, Neutral White (RGBW) 5.00mm L x 5.00mm W; MF: Adafruit Industries; MP: 2758; PACKAGE: SMD-4 Adafruit Industries; PRICE: None; SNAPEDA_LINK: https://www.snapeda.com/parts/2758/Adafruit+Industries+LLC/view-part/?ref=snap
Q1 = MMBT2222A:MMBT2222A: 2N2222 General Purpose NPN Transistor Check availability <https://pricing.snapeda.com/parts/MMBT2222A/Diotec%20Semiconductor/view-part?ref=eda>; AVAILABILITY: In Stock; CHECK_PRICES: https://www.snapeda.com/parts/MMBT2222A/Diotec/view-part/?ref=eda; DESCRIPTION: Bipolar (BJT) Transistor NPN 40 V 600 mA 250MHz 250 mW Surface Mount SOT-23-3 (TO-236); MF: Diotec Semiconductor; MP: MMBT2222A; PACKAGE: SOT-23-3 Diotec; PRICE: None; SNAPEDA_LINK: https://www.snapeda.com/parts/MMBT2222A/Diotec/view-part/?ref=snap
Q2 = microbuilder:MOSFET-P: P-Channel Mosfet LEGEND VDS: Voltage Drain-Source ID: Drain Current RDS(ON): Drain-Source On-State Resistance VGS(TH): Gate-Source Threshold Voltage CISS: Drain-Source Input Capacitance SOT-23 Name VDS ID RDS(ON) VGS(TH) CISS Order Number IRLML5103 30V 760mA 600 mOhm -- 75pF @ 25V Digikey: IRLML5103PBFCT-ND IRLML6401 12V 4.3A 50 mOhm 950mV @ 250µA 830pF @ 10V Digikey: IRLML6401PBFTR-ND NTR0202PL 20V 400mA 800 mOhm 2.3V @ 250uA 70pF @ 5V Digikey: NTR0202PLT1GOSTR-ND NTR4101PT1G 20V 1.8A 85 mOhm 1.2V @ 250uA 675pF @ 10V Digikey: NTR4101PT1GOSCT-ND DMP2004K 20V 600mA 900 mOhm 1V @ 250uA 175pF @ 16V Digikey: DMP2004KDICT-ND PMV65XP 20V 3.9A 76 mOhm 950mV @ 1mA 725pF @ 20V Digikey: 568-2358-2-ND TO-252 Name VDS ID RDS(ON) VGS(TH) CISS Order Number AOD417 30V 25A 34 mOhm 3V @ 250µA 920pF @ 15V Digikey: 785-1106-2-ND
R1 R2 R4-R6 R11-R16 R21 R22 R24-R27 R119-R124 THERM6 = microbuilder:RESISTOR: Resistors
R3 R9 = microbuilder:RESISTOR_4PACK: Resistor Packs (4 resistors) 4 x 0603 10K 1/16W - Digikey: YC164J-10KCT-ND
R28-R41 = SparkFun-Resistors:4.7KOHM: 4.7kΩ resistor A resistor is a passive two-terminal electrical component that implements electrical resistance as a circuit element. Resistors act to reduce current flow, and, at the same time, act to lower voltage levels within circuits. - Wikipedia; PROD_ID: RES-07857
R49 = SparkFun-Resistors:10KOHM: 10kΩ resistor A resistor is a passive two-terminal electrical component that implements electrical resistance as a circuit element. Resistors act to reduce current flow, and, at the same time, act to lower voltage levels within circuits. - Wikipedia; PROD_ID: RES-00824
S1 = MHSS1105:MHSS1105: APEM - MHSS1105 - SLIDE SWITCH, SPDT, 0.3A, 6VDC, TH Source: Datasheet <https://componentsearchengine.com/Datasheets/2/MHSS1105.pdf>; DESCRIPTION: APEM - MHSS1105 - SLIDE SWITCH, SPDT, 0.3A, 6VDC, TH; HEIGHT: 4mm; MANUFACTURER_NAME: Apem; MANUFACTURER_PART_NUMBER: MHSS1105; MOUSER_PART_NUMBER: 642-MHSS1105; MOUSER_PRICE-STOCK: https://www.mouser.co.uk/ProductDetail/Apem/MHSS1105?qs=pNV45xh2Ia0pDJDMcFqmnQ%3D%3D
T1 = Transistor:*-PNP_DRIVER-: PNP Bias Resistor Transistor
U1 = Texas Instruments - TPS61030PWP:TEXAS_INSTRUMENTS_TPS61030PWP: Boost Switching Regulator IC Positive Adjustable 1.8V 1 Output 3.6A (Switch) 16-TSSOP (0.173", 4.40mm Width) Exposed Pad; CENTROID_NOT_SPECIFIED: No; CURRENT_-_OUTPUT: 3.6A (Switch); DATASHEET: http://www.ti.com/lit/gpn/tps61030; DIGIKEY_DESCRIPTION: IC Boost Switching Regulator IC Positive Adjustable 1.8V 1 Output 3.6A (Switch) 16-TSSOP (0.173", 4.40mm Width) Exposed Pad; DIGIKEY_PART_NUMBER: 296-27006-5-ND; FREQUENCY_-_SWITCHING: 600kHz; FUNCTION: Step-Up; LEAD_FREE: yes; MF: Texas Instruments; MFG_PACKAGE_IDENT: PWP (R-PDSO-G16); MOUSER_PART_NUMBER: 595-TPS61030PWP; MPN: TPS61030PWP; OUTPUT_TYPE: Adjustable; PACKAGE: HTSSOP16; PREFIX: U; ROHS: yes; TEMPERATURE_RANGE_HIGH: +85°C; TEMPERATURE_RANGE_LOW: -40°C; VOLTAGE_-_INPUT_(MAX): 5.5V; VOLTAGE_-_INPUT_(MIN): 1.8V; VOLTAGE_-_OUTPUT_(MAX): 5.5V; VOLTAGE_-_OUTPUT_(MIN/FIXED): 1.8V
U3 = microbuilder:TB6612FNG: TB6612FNG Dual H-Bridge Motor Driver
U5 = SparkFun-IC-Logic:PCA9548A: Texas Instruments PCA9548A - I2C Multiplexer The PCA9548A device has eight bidirectional translating switches that can be controlled through the I2C bus. The SCL/SDA upstream pair fans out to eight downstream pairs, or channels. Any individual SCn/SDn channel or combination of channels can be selected, determined by the contents of the programmable control register. These downstream channels can be used to resolve I2C slave address conflicts.; PROD_ID: IC-13948
U16 = microbuilder:MCP73871: MCP73871 Lithium Polymer Battery Charger Digikey: MCP73871-2CCI/ML-ND
U$6 = microbuilder:BNO055: BNO055 - Motion Co-Processor
U$8 U$30-U$37 U$43 U$45-U$48 = microbuilder:MOUNTINGHOLE: Mounting Hole For #2 screws (0.086"/2.18mm width, 0.094"/2.4mm hole) use 2.5mm; BOM: EXCLUDE
U$12 = Gritsbot_Library:TPS61252: Texas Instrument 1.5-A Boost Converter With Adjustable Input Current Limit. (2.7 - 6V input range to 0 - 6.5V output)
U$57 = teensy:TEENSY40: Teensy 4.0 device including POGO pins for pins 24 - 33, but not yet pins for D+ and D-. Symbol layout is what works for me and may not suite everyone... that can be added or additional symbols can be created to be used in a modilied davie name.
X2 = adafruit2:XTAL: Low cost SMT crystals, no capacitors included http://www.ladyada.net/library/eagle

## Net classes
1 highpower: width 0.406 mm, drill 0.483 mm